# EAGLE design RFID-Controller-v10 (EAGLE 5.10)
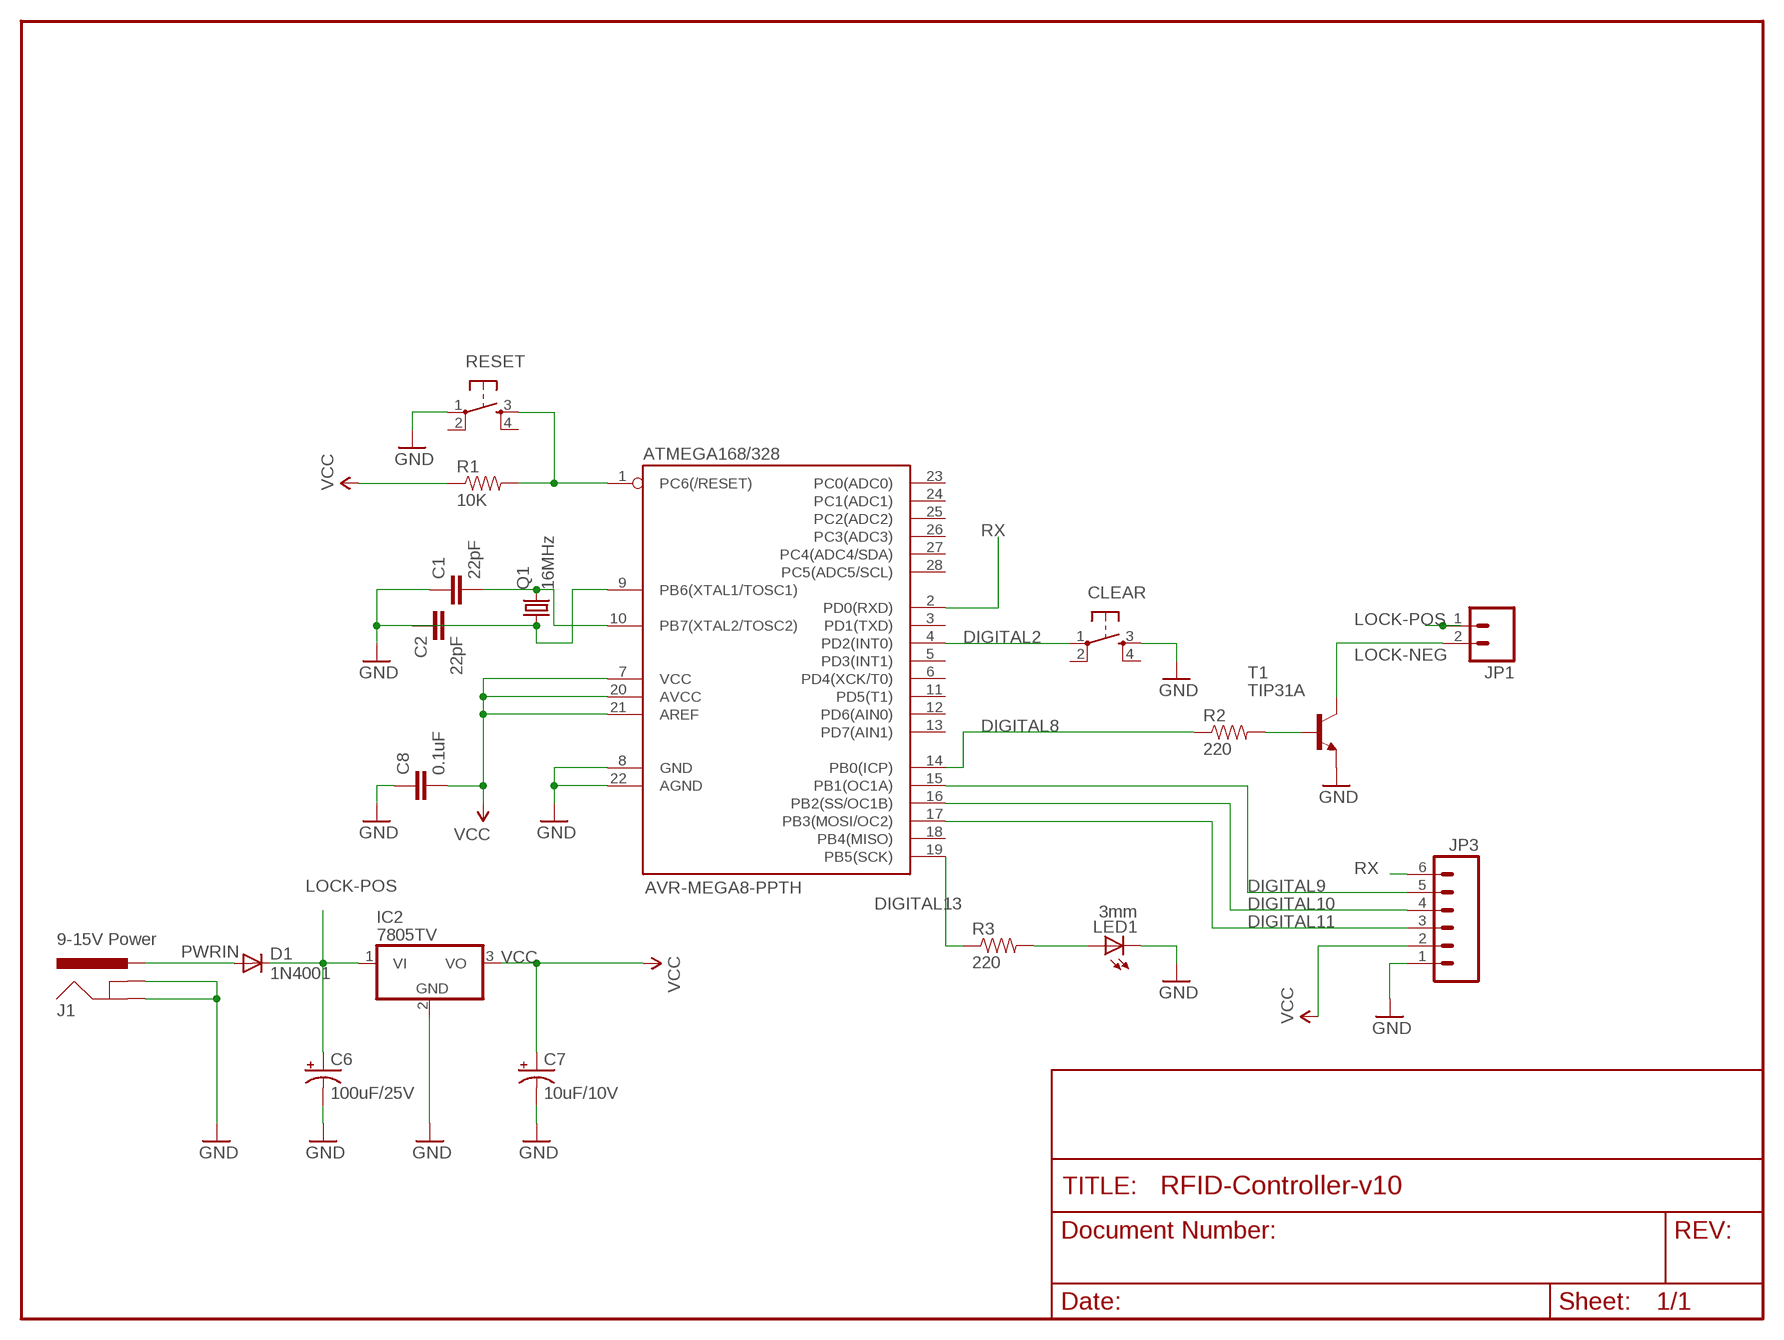
[diagram p0: schematic, sheet 1]

## Parts
ATMEGA168/328  AVR-MEGA8-PPTH  [DIL28-3]
C1  22pF  CAPPTH  [CAP-PTH-SMALL]
C2  22pF  CAPPTH  [CAP-PTH-SMALL]
C6  100uF/25V  CAP_POLPTH1  [CPOL-RADIAL-100UF-25V]
C7  10uF/10V  CAP_POLPTH2  [CPOL-RADIAL-10UF-25V]
C8  0.1uF  CAPPTH  [CAP-PTH-SMALL]
CLEAR  TAC_SWITCHPTH  [TACTILE-PTH]
D1  1N4001  DIODEPTH  [DIODE-1N4001]
IC2  7805TV  [TO220V]
J1  9-15V Power  POWER_JACKPTH  [POWER_JACK_PTH]
JP1  M02POLAR  [MOLEX-1X2]
JP3  M06POLAR  [MOLEX-1X6]
LED1  3mm  LED3MM  [LED3MM]
Q1  16MHz  CRYSTALHC49US  [HC49US]
R1  10K  RESISTORPTH-1/6W  [1/6W-RES]
R2  220  RESISTORPTH-1/6W  [1/6W-RES]
R3  220  RESISTORPTH-1/6W  [1/6W-RES]
RESET  TAC_SWITCHPTH  [TACTILE-PTH]
T1  TIP31A  [TO220]

## Nets
!RESET: ATMEGA168/328.1(PC6(/RESET)) R1.2 RESET.3
DIGITAL2: ATMEGA168/328.4(PD2(INT0)) CLEAR.1
DIGITAL8: ATMEGA168/328.14(PB0(ICP)) R2.1
DIGITAL9: ATMEGA168/328.15(PB1(OC1A)) JP3.5
DIGITAL10: ATMEGA168/328.16(PB2(SS/OC1B)) JP3.4
DIGITAL11: ATMEGA168/328.17(PB3(MOSI/OC2)) JP3.3
DIGITAL13: ATMEGA168/328.19(PB5(SCK)) R3.1
GND: ATMEGA168/328.8(GND) ATMEGA168/328.22(AGND) C1.1 C2.2 C6.2(-) C7.2(-) C8.1 CLEAR.3 IC2.2(GND) J1.GND J1.GNDBREAK JP3.1 LED1.K(C) RESET.1 T1.3(E)
LOCK-NEG: JP1.2 T1.2(C)
LOCK-POS: C6.1(+) D1.C IC2.1(VI) JP1.1
N$1: ATMEGA168/328.10(PB7(XTAL2/TOSC2)) C1.2 Q1.2
N$2: ATMEGA168/328.9(PB6(XTAL1/TOSC1)) C2.1 Q1.1
N$3: LED1.A R3.2
N$5: R2.2 T1.1(B)
PWRIN: D1.A J1.PWR
RX: ATMEGA168/328.2(PD0(RXD)) JP3.6
VCC: ATMEGA168/328.7(VCC) ATMEGA168/328.20(AVCC) ATMEGA168/328.21(AREF) C7.1(+) C8.2 IC2.3(VO) JP3.2 R1.1
Unconnected: ATMEGA168/328.3(PD1(TXD)) ATMEGA168/328.5(PD3(INT1)) ATMEGA168/328.6(PD4(XCK/T0)) ATMEGA168/328.11(PD5(T1)) ATMEGA168/328.12(PD6(AIN0)) ATMEGA168/328.13(PD7(AIN1)) ATMEGA168/328.18(PB4(MISO)) ATMEGA168/328.23(PC0(ADC0)) ATMEGA168/328.24(PC1(ADC1)) ATMEGA168/328.25(PC2(ADC2)) ATMEGA168/328.26(PC3(ADC3)) ATMEGA168/328.27(PC4(ADC4/SDA)) ATMEGA168/328.28(PC5(ADC5/SCL)) CLEAR.2 CLEAR.4 RESET.2 RESET.4

## Library data of the parts
ATMEGA168/328 = SparkFun:AVR-MEGA8-P: MICROCONTROLLER 8 Kbytes FLASH 1 kbytes SRAM 512 bytes EEPROM USART 4-channel 10 bit ADC 2-channel 8 bit ADC
C1 C2 C8 = SparkFun:CAP: Capacitor Standard 0603 ceramic capacitor, and 0.1" leaded capacitor.
C6 C7 = SparkFun:CAP_POL: Capacitor Polarized These are standard SMD and PTH capacitors. Normally 10uF, 47uF, and 100uF in electrolytic and tantalum varieties. Always verify the external diameter of the through hole cap, it varies with capacity, voltage, and manufacturer. The EIA devices should be standard.
CLEAR RESET = SparkFun:TAC_SWITCH: Momentary Switch Button commonly used for reset or general input. Spark Fun Electronics SKU : COM-00097
D1 = SparkFun:DIODE: Diode These are standard reverse protection diodes and small signal diodes. SMA package can handle up to about 1A. SOD-323 can handle about 200mA. What the SOD-323 package when ordering, there are some mfgs out there that are 5-pin packages.
IC2 = linear:78*: Positive VOLTAGE REGULATOR Source: http://cache.national.com/ds/LM/LM78L05.pdf http://www.fairchildsemi.com/ds/LM/LM7805.pdf
J1 = SparkFun:POWER_JACK: Power Jack This is the standard 5.5mm barrel jack for power. The PTH is the most common, proven, reliable, footprint. All others are experimental. The Slot footprint only works if the mill layer is transmitted to the PCB fab house so be warned. Spark Fun Electronics SKU : PRT-00119. Mating wall wart : TOL-00298 (and others)
JP1 = SparkFun:M02: Header 2 Standard 2-pin 0.1" header. Use with straight break away headers (SKU : PRT-00116), right angle break away headers (PRT-00553), swiss pins (PRT-00743), machine pins (PRT-00117), and female headers (PRT-00115). Molex polarized connector foot print use with SKU : PRT-08233 with associated crimp pins and housings.
JP3 = SparkFun:M06: Header 6 Standard 6-pin 0.1" header. Use with straight break away headers (SKU : PRT-00116), right angle break away headers (PRT-00553), swiss pins (PRT-00743), machine pins (PRT-00117), and female headers (PRT-00115). Molex polarized connector foot print use with SKU : PRT-08094 with associated crimp pins and housings. NOTES ON THE VARIANTS LOCK and LOCK_LONGPADS... This footprint was designed to help hold the alignment of a through-hole component (i.e. 6-pin header) while soldering it into place. You may notice that each hole has been shifted either up or down by 0.005 of an inch from it's more standard position (which is a perfectly straight line). This slight alteration caused the pins (the squares in the middle) to touch the edges of the holes. Because they are alternating, it causes a "brace" to hold the component in place. 0.005 has proven to be the perfect amount of "off-center" position when using our standard breakaway headers. Although looks a little odd when you look at the bare footprint, once you have a header in there, the alteration is very hard to notice. Also, if you push a header all the way into place, it is covered up entirely on the bottom side. This idea of altering the position of holes to aid alignment will be further integrated into the Sparkfun Library for other footprints. It can help hold any component with 3 or more connection pins.
LED1 = SparkFun:LED: LEDs Standard schematic elements and footprints for 5mm, 3mm, 1206, and 0603 sized LEDs. 5mm - Spark Fun Electronics SKU : COM-00529 (and others)
Q1 = SparkFun:CRYSTAL: Crystals Various standard crystals. Proven footprints. Spark Fun Electronics SKU : COM-00534
R1-R3 = SparkFun:RESISTOR: Resistor Basic schematic elements and footprints for 0603, 1206, and PTH 1/10th watt (small) resistors.
T1 = transistor:TIP31: NPN Transistor Medium Power Linear Switching Applications Source: http://onsemi.com

## Board
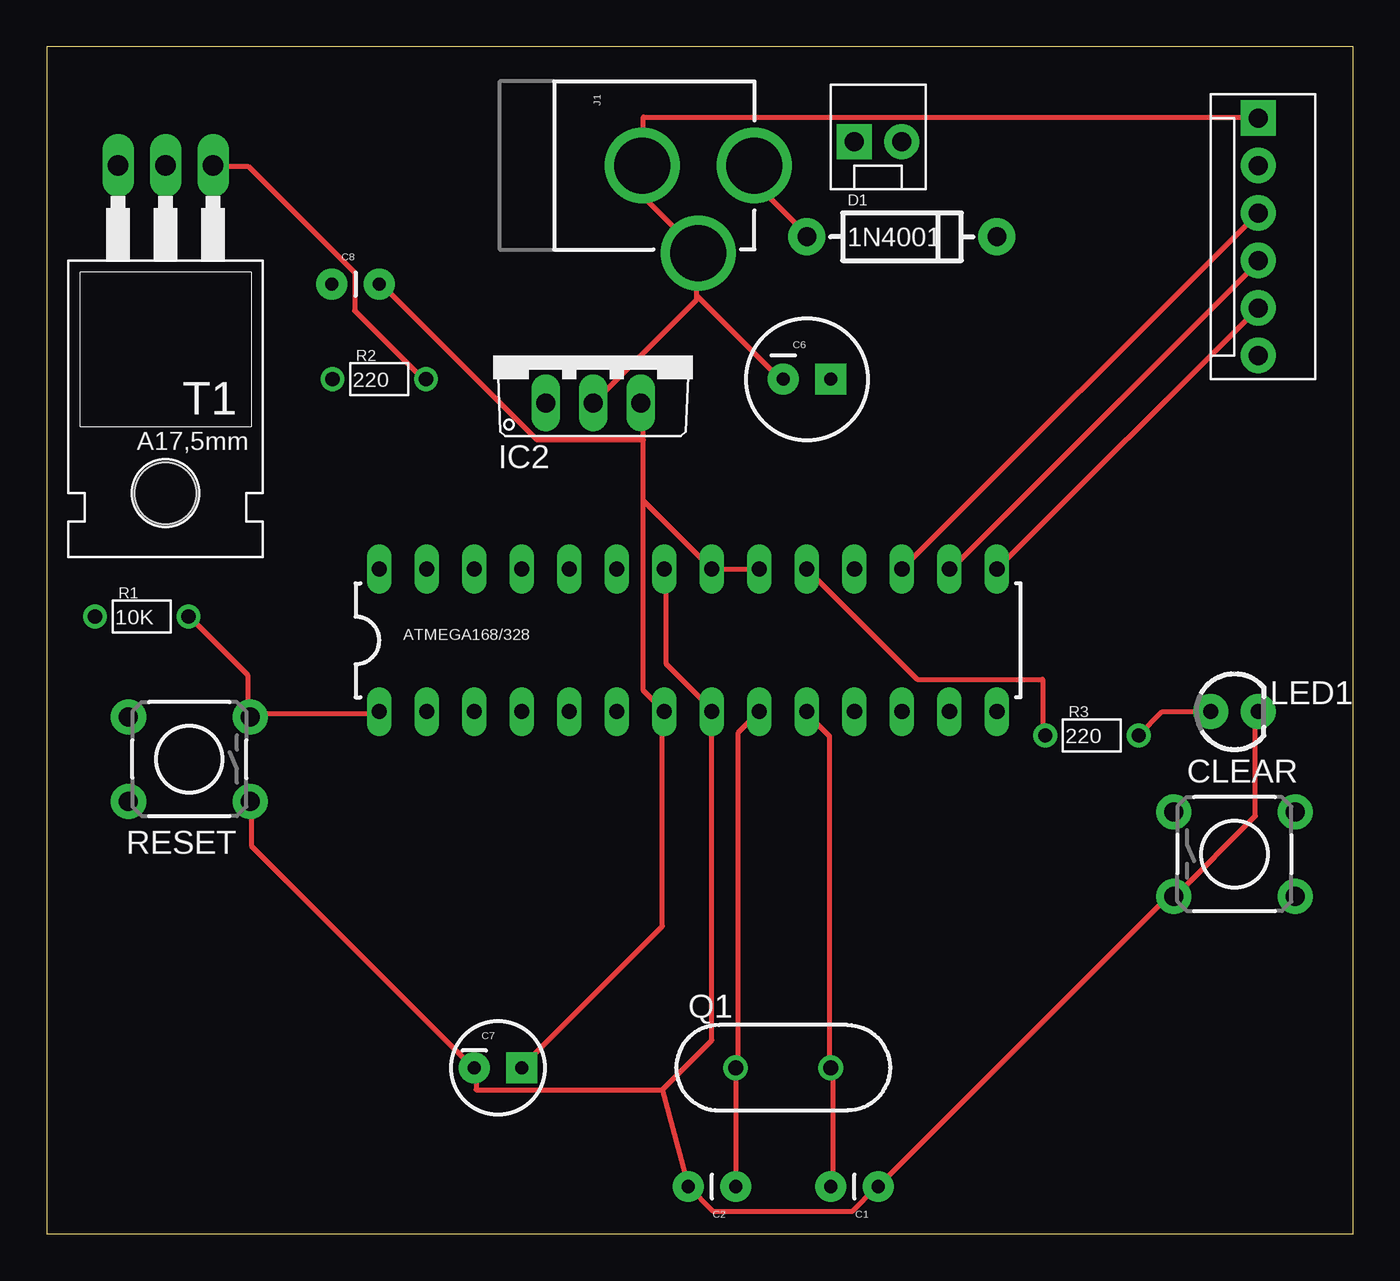
[diagram p1: board, top side]
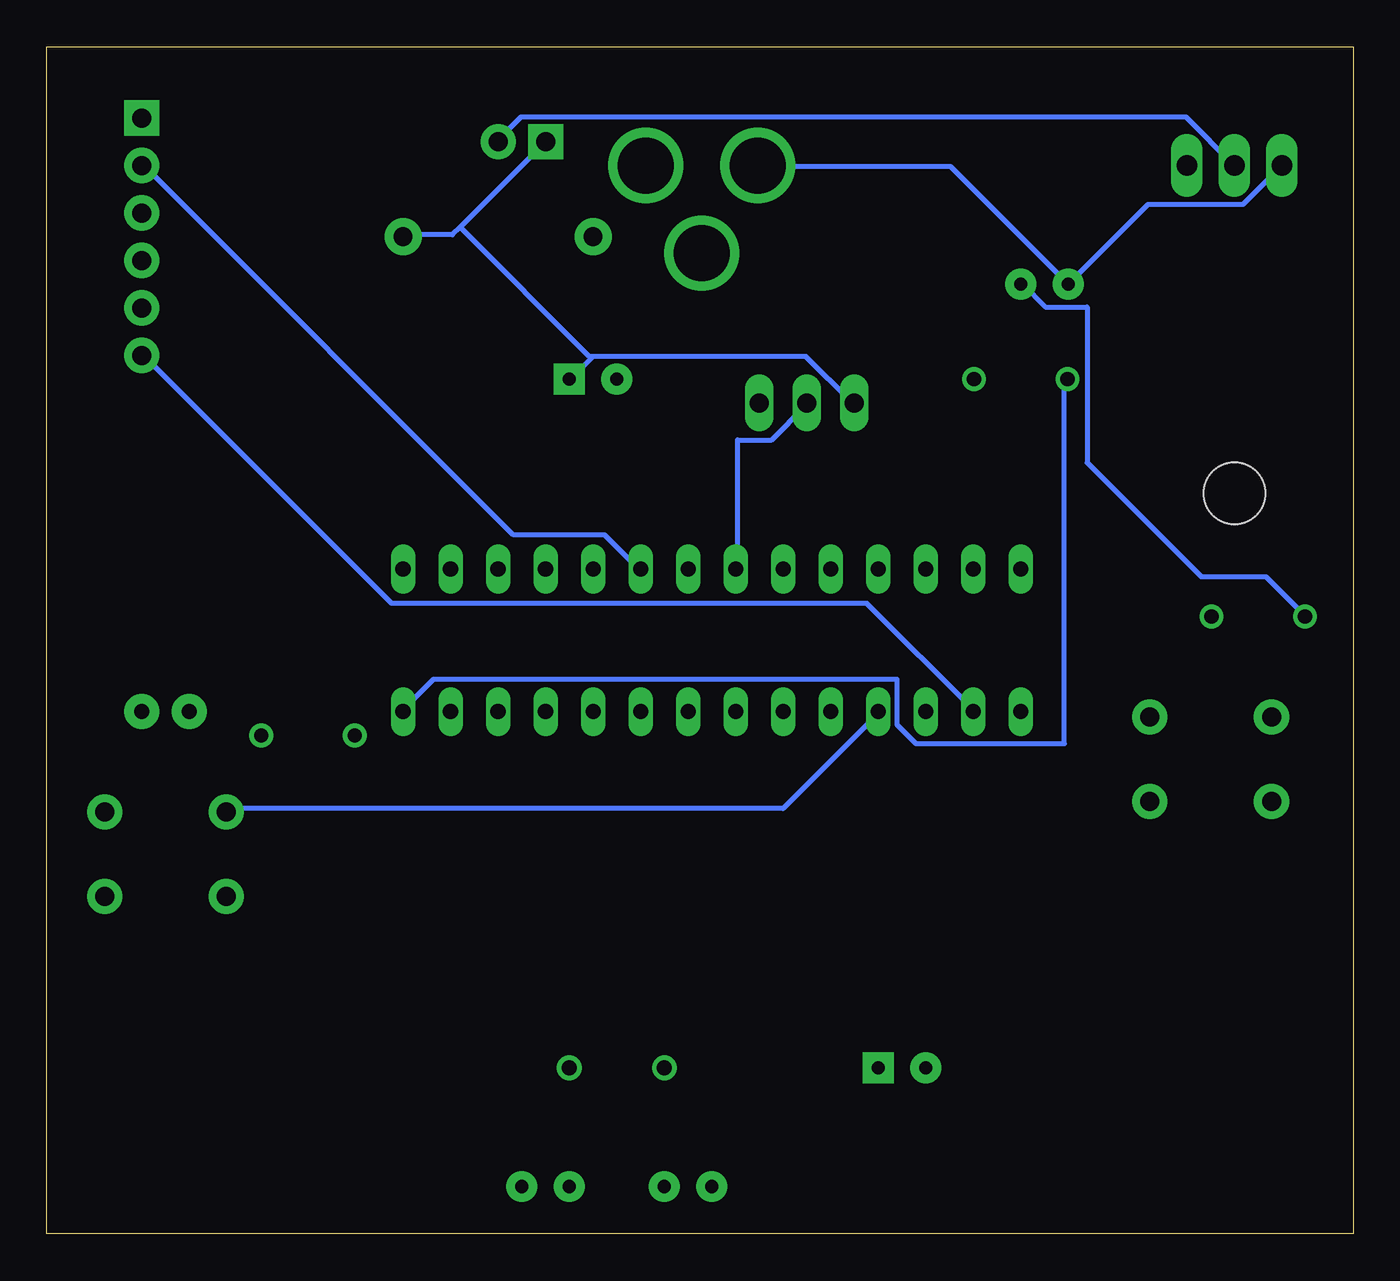
[diagram p2: board, bottom side, seen from below]

Size 69.85 x 63.5 mm. Coordinates in mm from the lower left corner, seen from the top.
Outline: 0,0 69.85,0 69.85,63.5 0,63.5 0,0
Copper layers (1*16): Top 0.035mm / dielectric 1.5mm / Bottom 0.035mm
Design rules "default": minimum track width 10mil, minimum drill 24mil, track to track 8mil, track to pad 8mil, pad to pad 8mil, via to via 8mil, smd to smd 8mil, copper to edge 40mil, drill to drill 8mil, minimum pad ring 10mil, minimum via ring 8mil, stop-mask expansion 4mil, vias tented up to drill 0mil, thermal gap 10mil

### Footprints (pad centres in the part's own frame; a part is rotated, then mirrored left to right if it is on the bottom)
DIL28-3 = drill 0.813 long: 1 -16.51,-3.81; 2 -13.97,-3.81; 3 -11.43,-3.81; 4 -8.89,-3.81; 5 -6.35,-3.81; 6 -3.81,-3.81; 7 -1.27,-3.81; 8 1.27,-3.81; 9 3.81,-3.81; 10 6.35,-3.81; 11 8.89,-3.81; 12 11.43,-3.81; 13 13.97,-3.81; 14 16.51,-3.81; 15 16.51,3.81; 16 13.97,3.81; 17 11.43,3.81; 18 8.89,3.81; 19 6.35,3.81; 20 3.81,3.81; 21 1.27,3.81; 22 -1.27,3.81; 23 -3.81,3.81; 24 -6.35,3.81; 25 -8.89,3.81; 26 -11.43,3.81; 27 -13.97,3.81; 28 -16.51,3.81
CAP-PTH-SMALL = drill 0.7 pad 1.651 round: 1 0,0; 2 2.54,0
CPOL-RADIAL-100UF-25V = drill 0.7 pad 1.651 square: 1 1.27,0 | drill 0.7 pad 1.651 round: 2 -1.27,0
CPOL-RADIAL-10UF-25V = drill 0.7 pad 1.651 square: 1 1.27,0 | drill 0.7 pad 1.651 round: 2 -1.27,0
TACTILE-PTH = drill 1.016 pad 1.88 round: 1 -3.251,2.261; 2 3.251,2.261; 3 -3.251,-2.261; 4 3.251,-2.261
DIODE-1N4001 = drill 1 pad 1.981 round: A -5.08,0; C 5.08,0
TO220V = drill 1.016 long: 1 -2.54,-2.54; 2 0,-2.54; 3 2.54,-2.54
POWER_JACK_PTH = drill 2.997 round: GND 0,7.7; GNDBREAK 4.7,10.7; PWR 0,13.7
MOLEX-1X2 = drill 1.016 pad 1.88 square: 1 0,0 | drill 1.016 pad 1.88 round: 2 2.54,0
MOLEX-1X6 = drill 1.016 pad 1.88 square: 1 0,0 | drill 1.016 pad 1.88 round: 2 2.54,0; 3 5.08,0; 4 7.62,0; 5 10.16,0; 6 12.7,0
LED3MM = drill 0.813 pad 1.88 round: A -1.27,0; K 1.27,0
HC49US = drill 0.813 round: 1 -2.54,0; 2 2.54,0
1/6W-RES = drill 0.762 round: 1 -2.5,0; 2 2.5,0
TO220 = drill 1.118 long: 1 -2.54,-6.35; 2 0,-6.35; 3 2.54,-6.35 | hole 3.302: 0,11.176

### Placement (x,y rotation side)
ATMEGA168/328  34.29,31.75 0 top
C1  44.45,2.54 180 top
C2  36.83,2.54 180 top
C6  40.64,45.72 0 top
C7  24.13,8.89 0 top
C8  15.24,50.8 0 top
CLEAR  63.5,20.32 0 top
D1  45.72,53.34 0 top
IC2  29.21,46.99 0 top
J1  24.13,57.15 270 top
JP1  43.18,58.42 0 top
JP3  64.77,59.69 270 top
LED1  63.5,27.94 0 top
Q1  39.37,8.89 0 top
R1  5.08,33.02 0 top
R2  17.78,45.72 0 top
R3  55.88,26.67 0 top
RESET  7.62,25.4 180 top
T1  6.35,50.8 180 top

### Tracks (layer width: path | path; a pad name or v marks a point on that pad's centre or on a via)
!RESET
  Top 0.254: R1.2 7.72,32.92 10.77,29.87 10.77,27.84 RESET.3 10.97,27.84 17.68,27.84 ATMEGA168/328.1
DIGITAL2
  Bottom 0.254: ATMEGA168/328.4 25.4,27.84 30.48,22.76 60.15,22.76 CLEAR.1
DIGITAL8
  Bottom 0.254: R2.1 15.44,45.72 15.44,26.21 23.37,26.21 24.38,27.23 24.38,29.67 49.17,29.67 50.8,28.04 ATMEGA168/328.14
DIGITAL9
  Top 0.254: ATMEGA168/328.15 JP3.5
DIGITAL10
  Top 0.254: ATMEGA168/328.16 48.36,35.56 64.62,51.82 64.62,52.02 JP3.4
DIGITAL11
  Top 0.254: ATMEGA168/328.17 JP3.3
DIGITAL13
  Top 0.254: ATMEGA168/328.19 46.53,29.67 53.24,29.67 53.24,26.82 R3.1
GND
  Top 0.254: LED1.K 64.62,27.84 64.62,22.35 60.35,18.09 CLEAR.3 59.97,18.06 C1.1 44.35,2.44 44.3,2.44 43.08,1.22 35.61,1.22 C2.2 32.92,7.72 | RESET.1 10.97,22.96 10.97,20.73 22.76,8.94 C7.2 22.96,8.74 22.96,7.72 32.92,7.72 | ATMEGA168/328.22 33.12,35.56 33.12,30.48 35.56,28.04 ATMEGA168/328.8 35.56,10.36 32.92,7.72 | 34.75,50.19 34.75,52.43 J1.GNDBREAK 34.75,52.63 31.9,55.47 31.9,57.1 J1.GND 31.9,57.3 31.9,59.74 64.62,59.74 JP3.1 | 34.75,50.19 34.75,49.99 IC2.2 | 34.75,50.19 39.22,45.72 C6.2
  Bottom 0.254: ATMEGA168/328.22 32.92,35.56 32.92,42.47 31.09,42.47 29.26,44.3 IC2.2 | T1.3 5.89,55.07 10.97,55.07 C8.1 21.54,57.1 31.7,57.1 J1.GND
LOCK-NEG
  Bottom 0.254: T1.2 8.94,59.74 44.5,59.74 45.72,58.52 JP1.2
LOCK-POS
  Bottom 0.254: 47.75,53.85 48.16,53.44 50.8,53.44 D1.C | 47.75,53.85 JP1.1 | 40.64,46.94 29.26,46.94 26.82,44.5 IC2.1 | 40.64,46.94 41.86,45.72 C6.1 | 47.75,53.85 40.84,46.94 40.64,46.94
N$1
  Top 0.254: C1.2 42.06,2.64 42.06,8.74 Q1.2 41.86,8.94 41.86,26.62 40.64,27.84 ATMEGA168/328.10
N$2
  Top 0.254: ATMEGA168/328.9 36.98,26.82 36.98,8.94 Q1.1 C2.1
N$3
  Top 0.254: LED1.A 59.65,27.94 R3.2
N$5
  Top 0.254: R2.2 20.12,45.72 16.46,49.38 16.46,51.41 10.77,57.1 8.94,57.1 T1.1
PWRIN
  Top 0.254: D1.A 40.64,53.44 38,56.08 38,57.1 J1.PWR
RX
  Bottom 0.254: ATMEGA168/328.2 20.32,28.04 26.01,33.73 51.41,33.73 64.62,46.94 JP3.6
VCC
  Top 0.254: ATMEGA168/328.20 ATMEGA168/328.21 31.9,39.22 | 31.9,42.47 31.9,44.3 IC2.3 | 31.9,39.22 31.9,42.47 | 31.9,39.22 31.9,29.06 ATMEGA168/328.7 32.92,27.84 32.92,16.46 25.4,8.94 C7.1 | 31.9,42.47 26.21,42.47 17.88,50.8 C8.2
  Bottom 0.254: R1.1 2.64,33.12 4.67,35.15 8.13,35.15 14.22,41.25 14.22,49.58 16.46,49.58 17.68,50.8 C8.2 | JP3.2 64.62,57.1 44.91,37.39 40.03,37.39 38.2,35.56 ATMEGA168/328.20